# Altium schematic sheet Block_Diagram.schdoc
size A; SheetNumber: 1; SheetTotal: 1
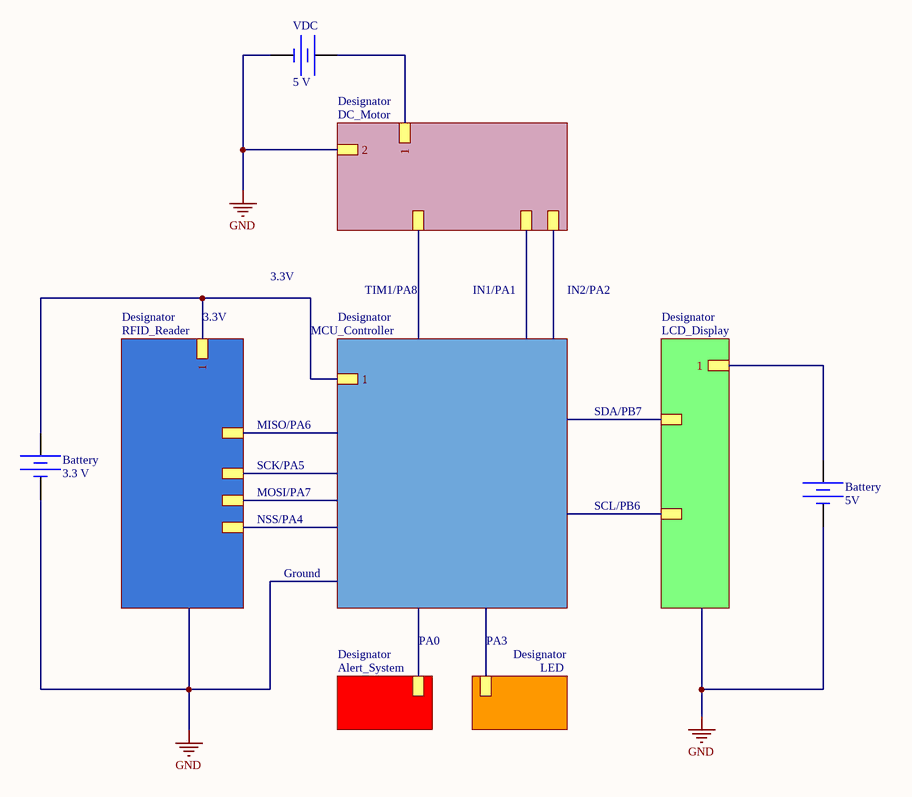
[diagram p0: Block_Diagram.schdoc]

## Parts
(Parts that share a designator on the sheet are numbered #1, #2 ... from top to bottom, then left to right.)
Battery#1  DC Magnitude: 3.3 V  (hidden comment: Constant Voltage Source)
Battery#2  DC Magnitude: 5V  (hidden comment: Constant Voltage Source)
VDC  DC Magnitude: 5 V  (hidden comment: Constant Voltage Source)

## Sub-sheets
Designator = MCU_Controller: 1
Designator = RFID_Reader: , 1, , , 
Designator = LCD_Display: 1, , 
Designator = Alert_System: no entries
Designator = LED: no entries
Designator = DC_Motor: , , 2, , 1

## Nets
GND: Battery#1.2 Battery#2.2 VDC.2 ; sheet Designator/2
NetBattery#1_1: Battery#1.1 ; sheet Designator/1, sheet Designator/1
NetBattery#2_1: Battery#2.1 ; sheet Designator/1
NetVDC_1: VDC.1 ; sheet Designator/1

## Notes on the sheet
- 3.3V
- TIM1/PA8
- IN1/PA1
- IN2/PA2
- MISO/PA6
- SDA/PB7
- SCK/PA5
- MOSI/PA7
- NSS/PA4
- SCL/PB6
- Ground
- PA0
- PA3

## Library data of the parts
Battery#1 Battery#2 VDC = Battery: SimulationGenericComponent: True